# EAGLE design mrShark 11 (EAGLE 6.4)

## Sheet 1 of 4
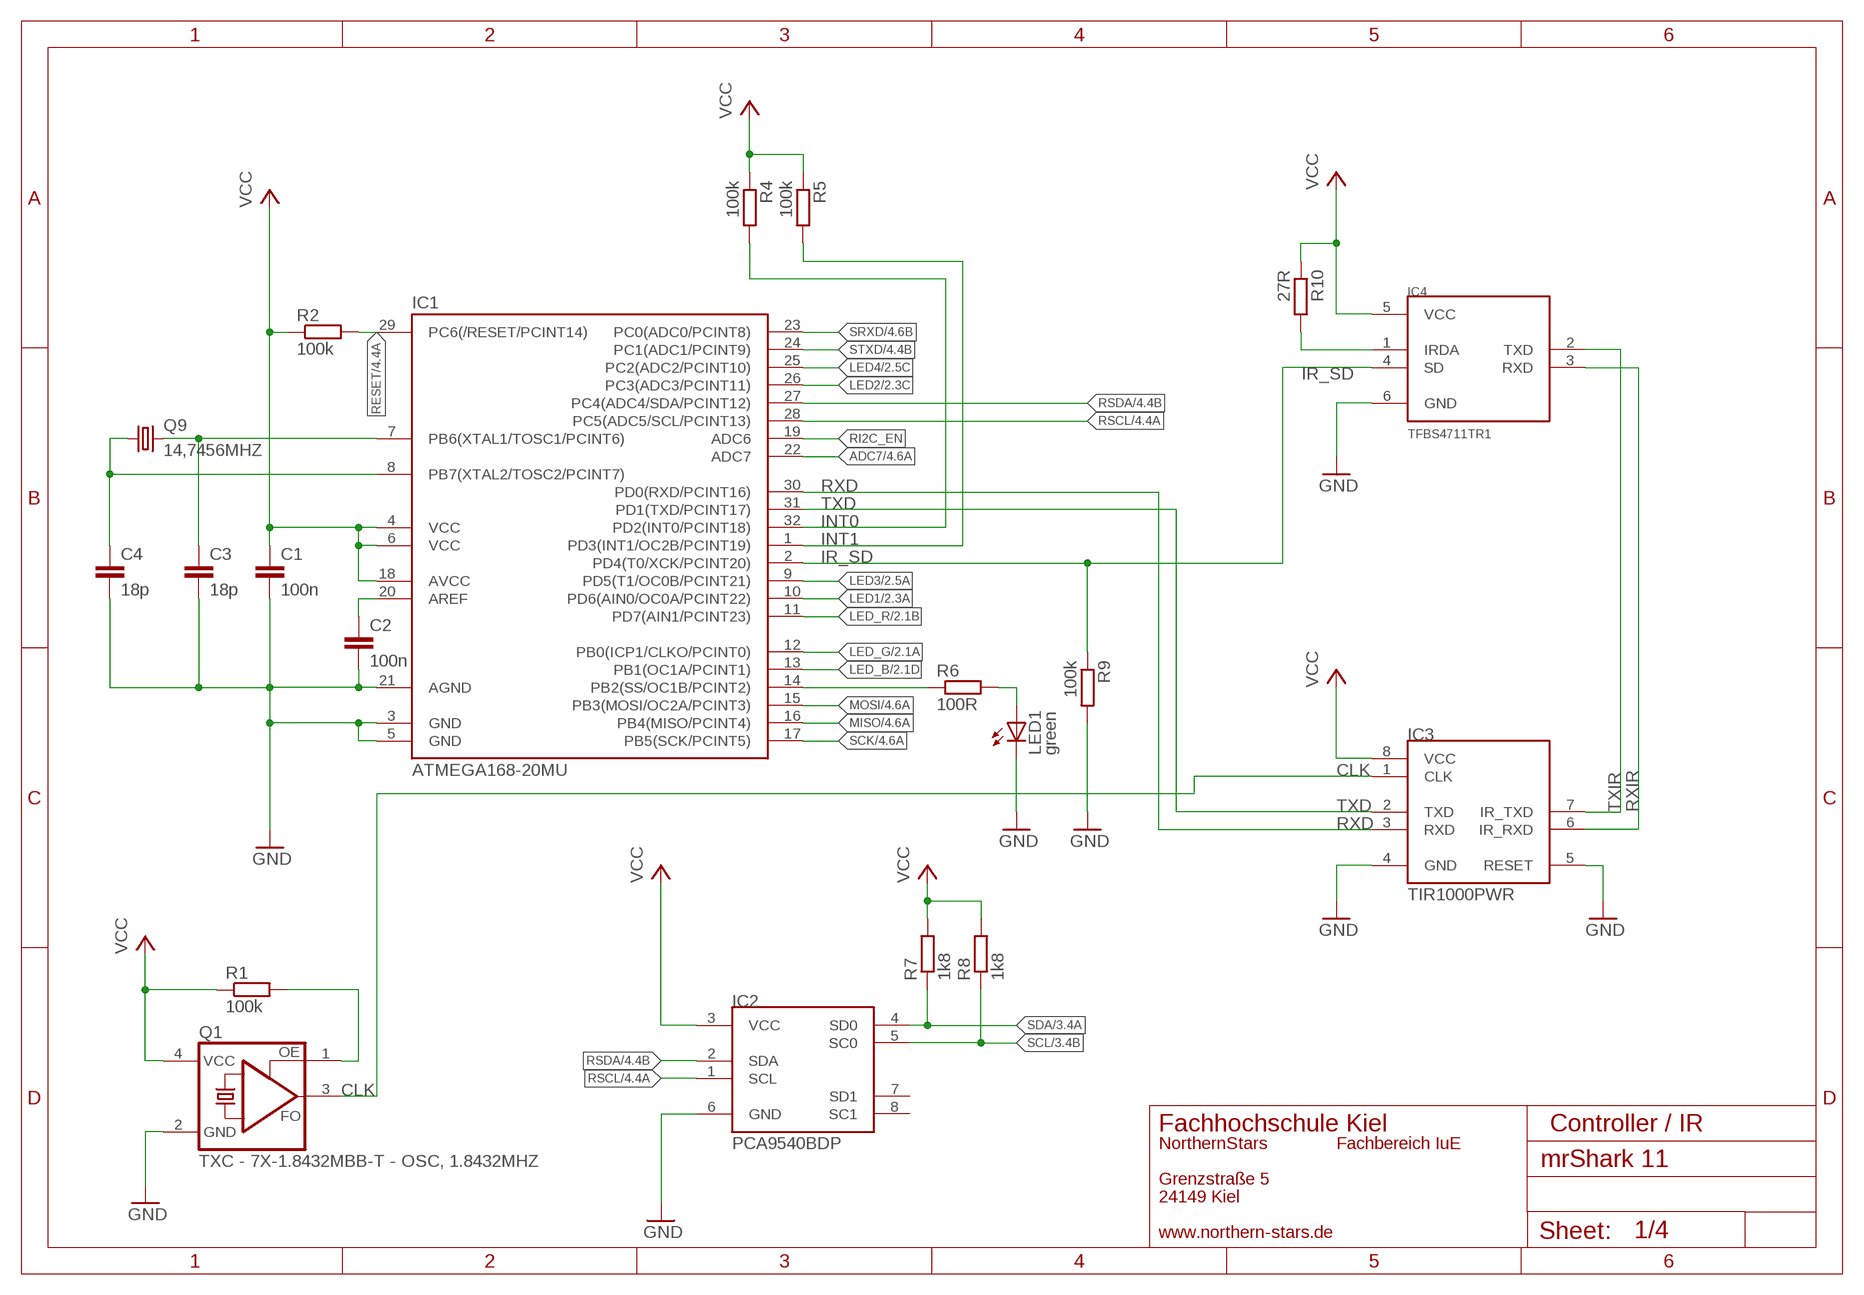
[diagram p0: schematic, sheet 1]

### Parts
C1  100n  C-EUC0201  [C0201]
C2  100n  C-EUC0201  [C0201]
C3  18p  C-EUC0201  [C0201]
C4  18p  C-EUC0201  [C0201]
IC1  ATMEGA168-20MU  ATMEGA48/88/168-MU  [MLF32]
IC2  PCA9540BDP  PCA9540TSSOP8  [TSSOP8]
IC3  TIR1000PWR  [PW_R-PDSO-G08]
IC4  TFBS4711TR1  [TFBS4711]
LED1  green  LEDCHIPLED_0603  [CHIPLED_0603]
Q1  TXC - 7X-1.8432MBB-T - OSC, 1.8432MHZ  7X-SERIES  [3.2X2.5]
Q9  14,7456MHZ  TXC-7B-SERIESSMD  [TXC_7B_SERIES]
R1  100k  R-EU_R0201  [R0201]
R2  100k  R-EU_R0201  [R0201]
R4  100k  R-EU_R0201  [R0201]
R5  100k  R-EU_R0201  [R0201]
R6  100R  R-EU_R0201  [R0201]
R7  1k8  R-EU_R0201  [R0201]
R8  1k8  R-EU_R0201  [R0201]
R9  100k  R-EU_R0201  [R0201]
R10  27R  R-EU_R0201  [R0201]

### Nets
ADC7: IC1.22(ADC7) ; also sheet 4
CLK: IC3.1(CLK) Q1.3(FO)
GND: C1.2 C2.2 C3.2 C4.2 IC1.3(GND) IC1.5(GND) IC1.21(AGND) IC2.6(GND) IC3.4(GND) IC3.5(RESET) IC4.6(GND) LED1.C Q1.2(GND) R9.2 ; also sheet 2,3,4
INT0: IC1.32(PD2(INT0/PCINT18)) R4.2 ; also sheet 4
INT1: IC1.1(PD3(INT1/OC2B/PCINT19)) R5.2 ; also sheet 4
IR_SD: IC1.2(PD4(T0/XCK/PCINT20)) IC4.4(SD) R9.1
IRDA: IC4.1(IRDA) R10.2
LED1: IC1.10(PD6(AIN0/OC0A/PCINT22)) ; also sheet 2
LED2: IC1.26(PC3(ADC3/PCINT11)) ; also sheet 2
LED3: IC1.9(PD5(T1/OC0B/PCINT21)) ; also sheet 2
LED4: IC1.25(PC2(ADC2/PCINT10)) ; also sheet 2
LED_B: IC1.13(PB1(OC1A/PCINT1)) ; also sheet 2
LED_G: IC1.12(PB0(ICP1/CLKO/PCINT0)) ; also sheet 2
LED_R: IC1.11(PD7(AIN1/PCINT23)) ; also sheet 2
MISO: IC1.16(PB4(MISO/PCINT4)) ; also sheet 4
MOSI: IC1.15(PB3(MOSI/OC2A/PCINT3)) ; also sheet 4
N$3: IC1.14(PB2(SS/OC1B/PCINT2)) R6.1
N$4: Q1.1(OE) R1.2
N$8: LED1.A R6.2
N$26: C2.1 IC1.20(AREF)
RESET: IC1.29(PC6(/RESET/PCINT14)) R2.2 ; also sheet 4
RI2C_EN: IC1.19(ADC6)
RSCL: IC1.28(PC5(ADC5/SCL/PCINT13)) IC2.1(SCL) ; also sheet 4
RSDA: IC1.27(PC4(ADC4/SDA/PCINT12)) IC2.2(SDA) ; also sheet 4
RXD: IC1.30(PD0(RXD/PCINT16)) IC3.3(RXD)
RXIR: IC3.6(IR_RXD) IC4.3(RXD)
SCK: IC1.17(PB5(SCK/PCINT5)) ; also sheet 4
SCL: IC2.5(SC0) R8.1 ; also sheet 3,4
SDA: IC2.4(SD0) R7.1 ; also sheet 3,4
SRXD: IC1.23(PC0(ADC0/PCINT8)) ; also sheet 4
STXD: IC1.24(PC1(ADC1/PCINT9)) ; also sheet 4
TXD: IC1.31(PD1(TXD/PCINT17)) IC3.2(TXD)
TXIR: IC3.7(IR_TXD) IC4.2(TXD)
VCC: C1.1 IC1.4(VCC) IC1.6(VCC) IC1.18(AVCC) IC2.3(VCC) IC3.8(VCC) IC4.5(VCC) Q1.4(VCC) R1.1 R2.1 R4.1 R5.1 R7.2 R8.2 R10.1 ; also sheet 2,3,4
XTAL1: C3.1 IC1.7(PB6(XTAL1/TOSC1/PCINT6)) Q9.3
XTAL2: C4.1 IC1.8(PB7(XTAL2/TOSC2/PCINT7)) Q9.1
Unconnected: IC2.7(SD1) IC2.8(SC1)

### Notes on the sheet
- Fachhochschule Kiel | Controller / IR
- NorthernStars | Fachbereich IuE
- Grenzstraße 5
- 24149 Kiel
- www.northern-stars.de

## Sheet 2 of 4
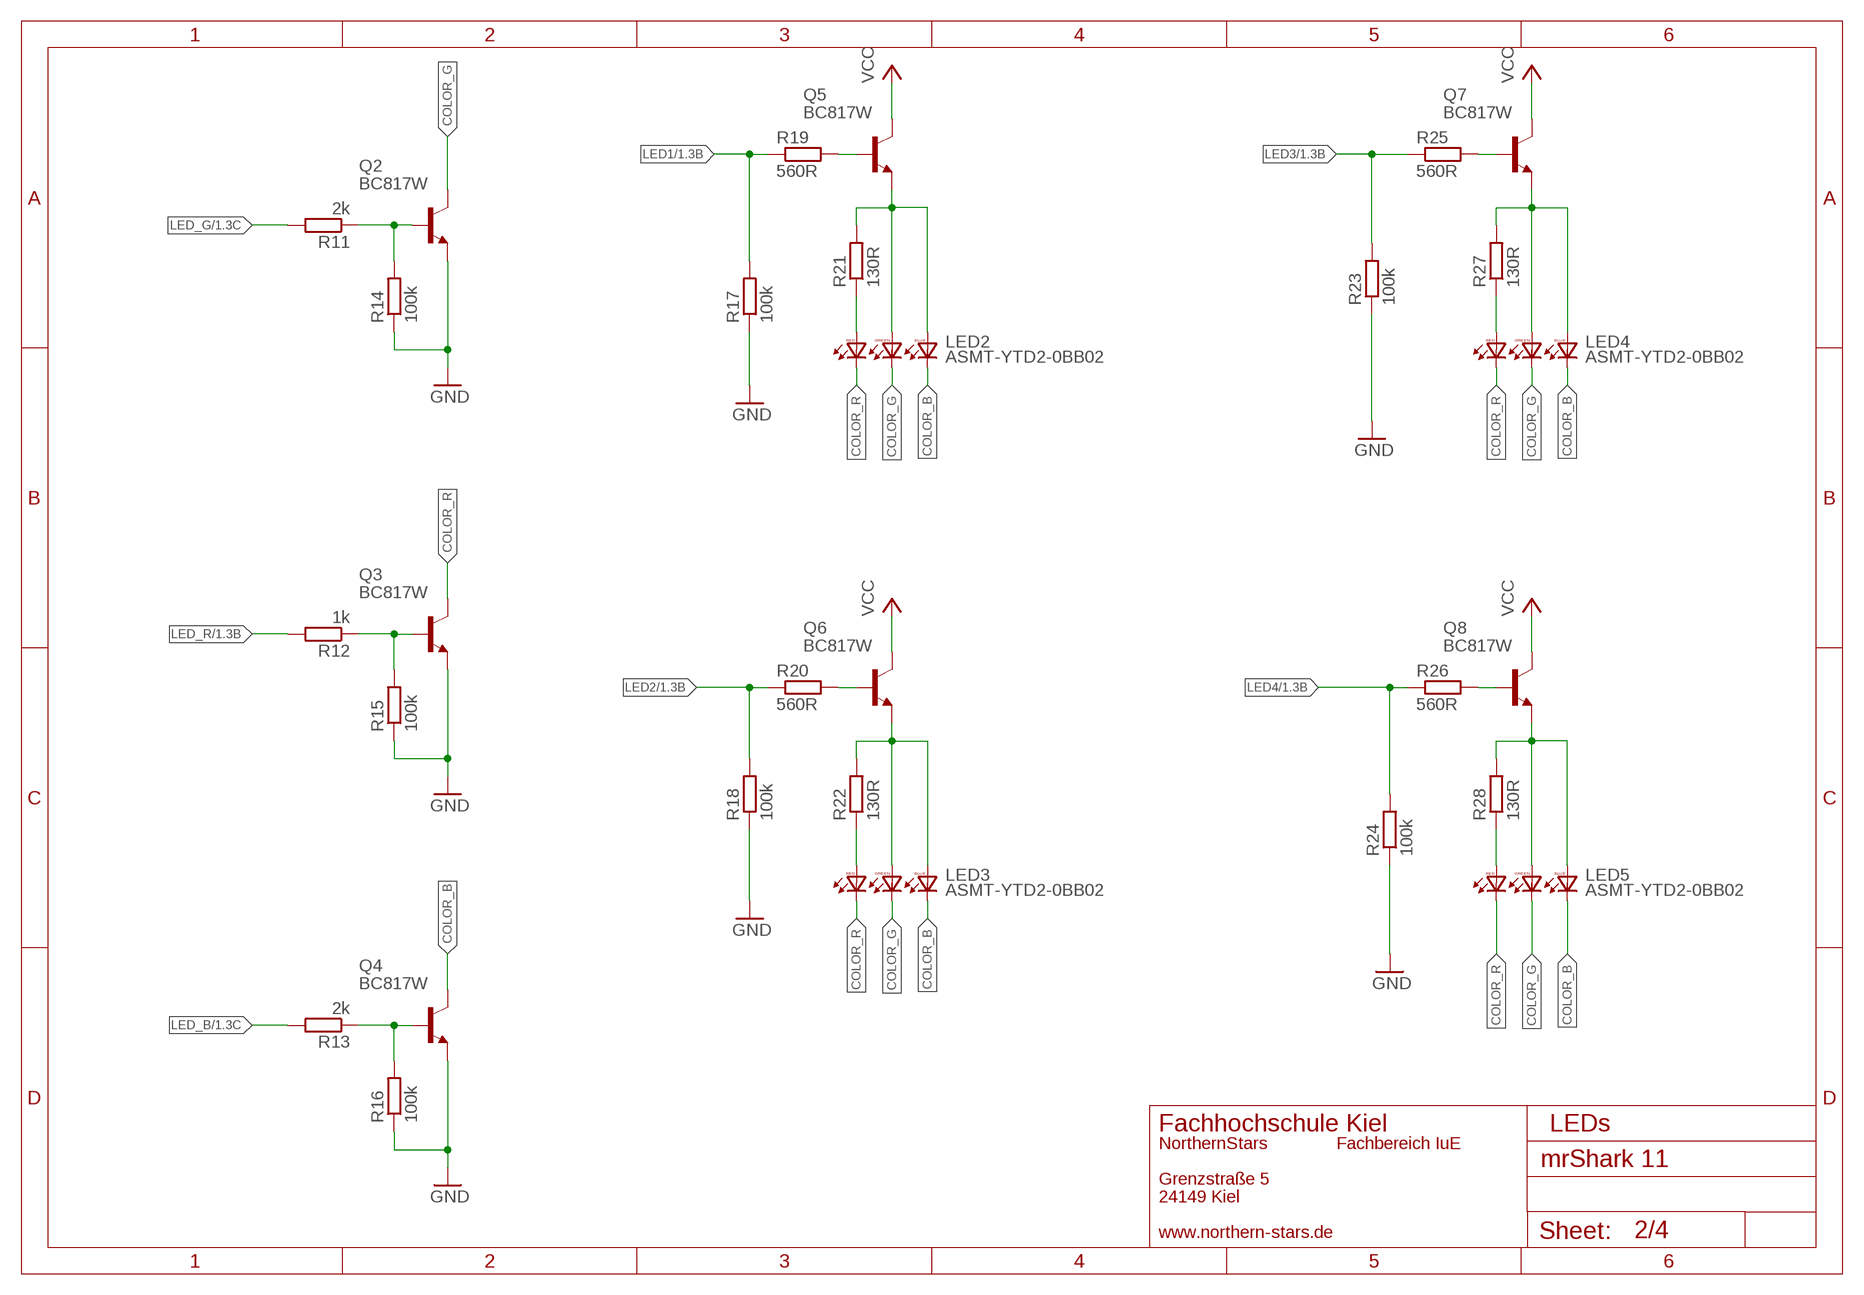
[diagram p1: schematic, sheet 2]

### Parts
LED2  ASMT-YTD2-0BB02  PLCC6K  [PLCC6K]
LED3  ASMT-YTD2-0BB02  PLCC6K  [PLCC6K]
LED4  ASMT-YTD2-0BB02  PLCC6K  [PLCC6K]
LED5  ASMT-YTD2-0BB02  PLCC6K  [PLCC6K]
Q2  BC817W  [SOT323-BEC]
Q3  BC817W  [SOT323-BEC]
Q4  BC817W  [SOT323-BEC]
Q5  BC817W  [SOT323-BEC]
Q6  BC817W  [SOT323-BEC]
Q7  BC817W  [SOT323-BEC]
Q8  BC817W  [SOT323-BEC]
R11  2k  R-EU_R0201  [R0201]
R12  1k  R-EU_R0201  [R0201]
R13  2k  R-EU_R0201  [R0201]
R14  100k  R-EU_R0201  [R0201]
R15  100k  R-EU_R0201  [R0201]
R16  100k  R-EU_R0201  [R0201]
R17  100k  R-EU_R0201  [R0201]
R18  100k  R-EU_R0201  [R0201]
R19  560R  R-EU_R0201  [R0201]
R20  560R  R-EU_R0201  [R0201]
R21  130R  R-EU_R0201  [R0201]
R22  130R  R-EU_R0201  [R0201]
R23  100k  R-EU_R0201  [R0201]
R24  100k  R-EU_R0201  [R0201]
R25  560R  R-EU_R0201  [R0201]
R26  560R  R-EU_R0201  [R0201]
R27  130R  R-EU_R0201  [R0201]
R28  130R  R-EU_R0201  [R0201]

### Nets
COLOR_B: LED2.1(BC) LED3.1(BC) LED4.1(BC) LED5.1(BC) Q4.C
COLOR_G: LED2.2(GC) LED3.2(GC) LED4.2(GC) LED5.2(GC) Q2.C
COLOR_R: LED2.3(RC) LED3.3(RC) LED4.3(RC) LED5.3(RC) Q3.C
GND: Q2.E Q3.E Q4.E R14.1 R15.1 R16.1 R17.1 R18.1 R23.1 R24.1 ; also sheet 1,3,4
LED1: R17.2 R19.1 ; also sheet 1
LED2: R18.2 R20.1 ; also sheet 1
LED3: R23.2 R25.1 ; also sheet 1
LED4: R24.2 R26.1 ; also sheet 1
LED_B: R13.2 ; also sheet 1
LED_G: R11.2 ; also sheet 1
LED_R: R12.2 ; also sheet 1
N$5: LED2.4(RA) R21.1
N$10: LED4.4(RA) R27.1
N$11: LED4.5(GA) LED4.6(BA) Q7.E R27.2
N$15: LED3.4(RA) R22.1
N$16: LED3.5(GA) LED3.6(BA) Q6.E R22.2
N$19: Q6.B R20.2
N$20: LED5.4(RA) R28.1
N$22: LED5.5(GA) LED5.6(BA) Q8.E R28.2
N$23: Q8.B R26.2
N$24: Q7.B R25.2
N$25: Q5.B R19.2
N$27: LED2.5(GA) LED2.6(BA) Q5.E R21.2
VCC: Q5.C Q6.C Q7.C Q8.C ; also sheet 1,3,4
X1: Q4.B R13.1 R16.2
X2: Q3.B R12.1 R15.2
X3: Q2.B R11.1 R14.2

### Notes on the sheet
- Fachhochschule Kiel | LEDs
- NorthernStars | Fachbereich IuE
- Grenzstraße 5
- 24149 Kiel
- www.northern-stars.de

## Sheet 3 of 4
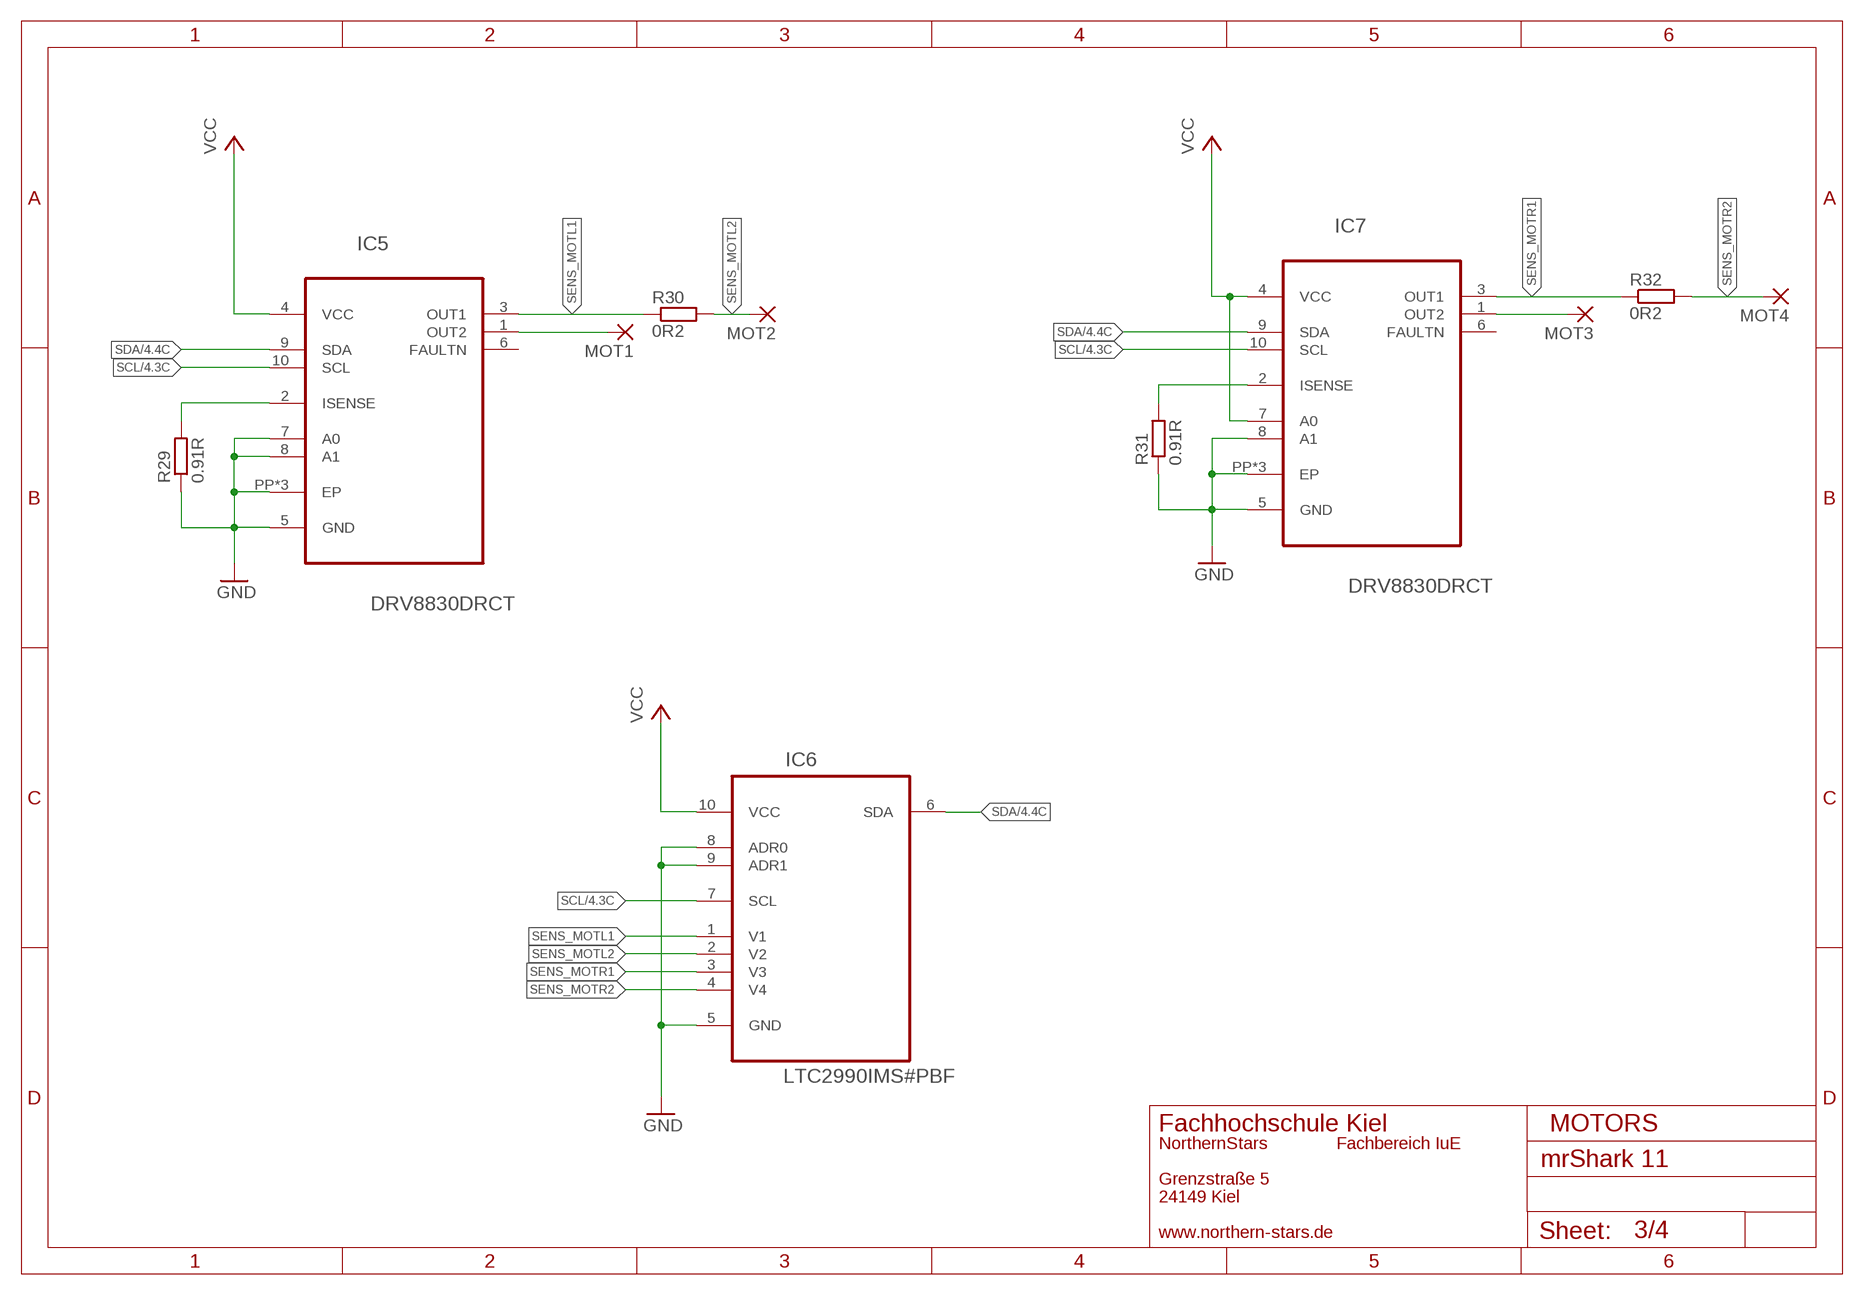
[diagram p2: schematic, sheet 3]

### Parts
IC5  DRV8830DRCT  DRV8830DGQRWSON  [S-PDSO-N10]
IC6  LTC2990IMS#PBF  LTC2990IMSPBF  [SOP50P490X110-10N]
IC7  DRV8830DRCT  DRV8830DGQRWSON  [S-PDSO-N10]
MOT1  1,6/0,9  [1,6/0,9]
MOT2  1,6/0,9  [1,6/0,9]
MOT3  1,6/0,9  [1,6/0,9]
MOT4  1,6/0,9  [1,6/0,9]
R29  0.91R  R-EU_R0603  [R0603]
R30  0R2  R-EU_R0603  [R0603]
R31  0.91R  R-EU_R0603  [R0603]
R32  0R2  R-EU_R0603  [R0603]

### Nets
GND: IC5.5(GND) IC5.7(A0) IC5.8(A1) IC5.PP(EP) IC5.PP@1(EP) IC5.PP@2(EP) IC6.5(GND) IC6.8(ADR0) IC6.9(ADR1) IC7.5(GND) IC7.8(A1) IC7.PP(EP) IC7.PP@1(EP) IC7.PP@2(EP) R29.1 R31.1 ; also sheet 1,2,4
N$1: IC5.1(OUT2) MOT1.1(P)
N$2: IC5.2(ISENSE) R29.2
N$6: IC7.1(OUT2) MOT3.1(P)
N$7: IC7.2(ISENSE) R31.2
SCL: IC5.10(SCL) IC6.7(SCL) IC7.10(SCL) ; also sheet 1,4
SDA: IC5.9(SDA) IC6.6(SDA) IC7.9(SDA) ; also sheet 1,4
SENS_MOTL1: IC5.3(OUT1) IC6.1(V1) R30.1
SENS_MOTL2: IC6.2(V2) MOT2.1(P) R30.2
SENS_MOTR1: IC6.3(V3) IC7.3(OUT1) R32.1
SENS_MOTR2: IC6.4(V4) MOT4.1(P) R32.2
VCC: IC5.4(VCC) IC6.10(VCC) IC7.4(VCC) IC7.7(A0) ; also sheet 1,2,4
Unconnected: IC5.6(FAULTN) IC7.6(FAULTN)

### Notes on the sheet
- Fachhochschule Kiel | MOTORS
- NorthernStars | Fachbereich IuE
- Grenzstraße 5
- 24149 Kiel
- www.northern-stars.de

## Sheet 4 of 4
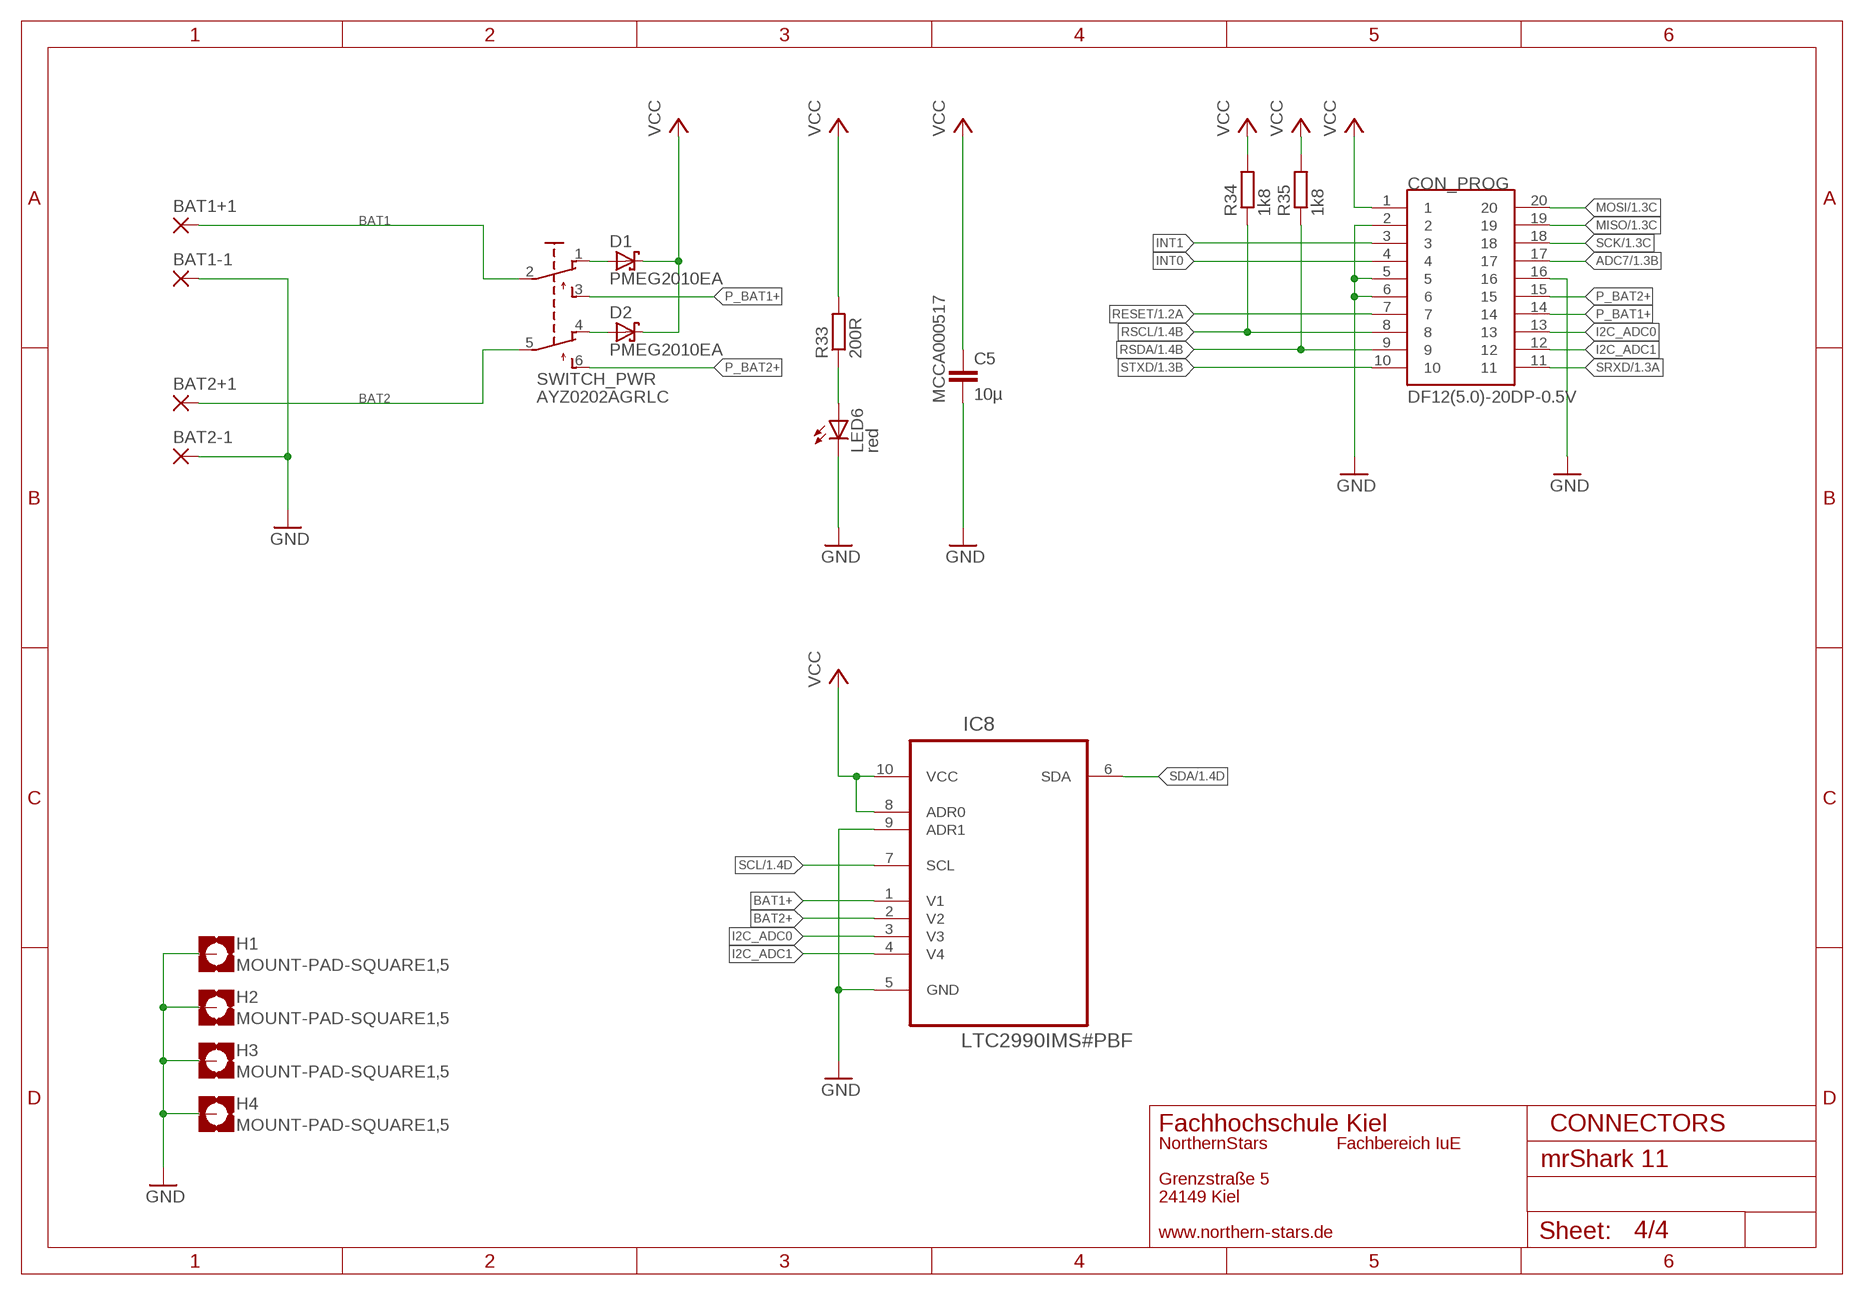
[diagram p3: schematic, sheet 4]

### Parts
BAT1+1  1,6/0,9  [1,6/0,9]
BAT1-1  1,6/0,9  [1,6/0,9]
BAT2+1  1,6/0,9  [1,6/0,9]
BAT2-1  1,6/0,9  [1,6/0,9]
C5  10µ  C-EUC0603K  [C0603K]
CON_PROG  DF12(5.0)-20DP-0.5V  DF12-20DP  [DF12-20DP]
D1  PMEG2010EA  PMEG2010EAR  [SOD323-R]
D2  PMEG2010EA  PMEG2010EAR  [SOD323-R]
H1  MOUNT-PAD-SQUARE1,5  [0,75-PAD-SQUARE]
H2  MOUNT-PAD-SQUARE1,5  [0,75-PAD-SQUARE]
H3  MOUNT-PAD-SQUARE1,5  [0,75-PAD-SQUARE]
H4  MOUNT-PAD-SQUARE1,5  [0,75-PAD-SQUARE]
IC8  LTC2990IMS#PBF  LTC2990IMSPBF  [SOP50P490X110-10N]
LED6  red  LEDCHIPLED_0603  [CHIPLED_0603]
R33  200R  R-EU_R0201  [R0201]
R34  1k8  R-EU_R0201  [R0201]
R35  1k8  R-EU_R0201  [R0201]
SWITCH_PWR  AYZ0202AGRLC  [AYZ0202AGLRC]

### Nets
ADC7: CON_PROG.17 ; also sheet 1
BAT1: BAT1+1.1(P) SWITCH_PWR.2(P)
BAT1+: D1.A IC8.1(V1) SWITCH_PWR.1(O)
BAT2: BAT2+1.1(P) SWITCH_PWR.5(P1)
BAT2+: D2.A IC8.2(V2) SWITCH_PWR.4(O1)
GND: BAT1-1.1(P) BAT2-1.1(P) C5.2 CON_PROG.2 CON_PROG.5 CON_PROG.6 CON_PROG.16 H1.P(MOUNT) H2.P(MOUNT) H3.P(MOUNT) H4.P(MOUNT) IC8.5(GND) IC8.9(ADR1) LED6.C ; also sheet 1,2,3
I2C_ADC0: CON_PROG.13 IC8.3(V3)
I2C_ADC1: CON_PROG.12 IC8.4(V4)
INT0: CON_PROG.4 ; also sheet 1
INT1: CON_PROG.3 ; also sheet 1
MISO: CON_PROG.19 ; also sheet 1
MOSI: CON_PROG.20 ; also sheet 1
N$28: LED6.A R33.1
P_BAT1+: CON_PROG.14 SWITCH_PWR.3(S)
P_BAT2+: CON_PROG.15 SWITCH_PWR.6(S1)
RESET: CON_PROG.7 ; also sheet 1
RSCL: CON_PROG.8 R34.1 ; also sheet 1
RSDA: CON_PROG.9 R35.1 ; also sheet 1
SCK: CON_PROG.18 ; also sheet 1
SCL: IC8.7(SCL) ; also sheet 1,3
SDA: IC8.6(SDA) ; also sheet 1,3
SRXD: CON_PROG.11 ; also sheet 1
STXD: CON_PROG.10 ; also sheet 1
VCC: C5.1 CON_PROG.1 D1.C D2.C IC8.8(ADR0) IC8.10(VCC) R33.2 R34.2 R35.2 ; also sheet 1,2,3

### Notes on the sheet
- MCCA000517
- Fachhochschule Kiel | CONNECTORS
- NorthernStars | Fachbereich IuE
- Grenzstraße 5
- 24149 Kiel
- www.northern-stars.de

## Library data of the parts
BAT1+1 BAT1-1 BAT2+1 BAT2-1 MOT1-MOT4 = wirepad:1,6/0,9: THROUGH-HOLE PAD
C1-C5 = rcl:C-EU: CAPACITOR, European symbol
CON_PROG = con-hirose:DF12-20: HRS-Hirose DF12-Series 0.5mm Pitch SMT Board to Board Connector 20 contacts
D1 D2 = diode:PMEG2010EA: NXP - Low V F (MEGA) Schottky barrier diode If = 1A, Vr = 20V http://www.farnell.com/datasheets/687996.pdf
H1-H4 = holes:MOUNT-PAD-SQUARE: MOUNTING PAD, square
IC1 = atmega8:ATMEGA48/88/168
IC2 = nxp:PCA9540: PCA9540 2-channel I2C-bus multiplexer
IC3 = texas:TIR1000: Texas Instruments TIR1000 STANDALONE IrDATM ENCODER AND DECODER
IC4 = vishay:TFBS4711: TRANSCEIVER IRDA Vishay TFBS4711-TR1 Infrared Transciever 900nm, 600µA, 1m range
IC5 IC7 = texas:DRV8830DGQR: LOW-VOLTAGE MOTOR DRIVER WITH SERIAL INTERFACE
IC6 IC8 = linear-technology:LTC2990IMSPBF: Quad I2C Voltage, Current and Temperature Monitor Measures Voltage, Current and Temperature Measures Two Remote Diode Temperatures; DESCRIPTION: I2C Temperature, Voltage and Current Monitor; MPN: LTC2990IMS#PBF; OC_FARNELL: 1898629; OC_NEWARK: 13T3889; PACKAGE: MSOP-10; SUPPLIER: Linear Technology
LED1 LED6 = led:LED: LED OSRAM: - CHIPLED LG R971, LG N971, LY N971, LG Q971, LY Q971, LO R971, LY R971 LH N974, LH R974 LS Q976, LO Q976, LY Q976 LO Q996 - Hyper CHIPLED LW Q18S LB Q993, LB Q99A, LB R99A - SideLED LS A670, LO A670, LY A670, LG A670, LP A670 LB A673, LV A673, LT A673, LW A673 LH A674 LY A675 LS A676, LA A676, LO A676, LY A676, LW A676 LS A679, LY A679, LG A679 - Hyper Micro SIDELED® LS Y876, LA Y876, LO Y876, LY Y876 LT Y87S - SmartLED LW L88C, LW L88S LB L89C, LB L89S, LG L890 LS L89K, LO L89K, LY L89K LS L896, LA L896, LO L896, LY L896 - TOPLED LS T670, LO T670, LY T670, LG T670, LP T670 LSG T670, LSP T670, LSY T670, LOP T670, LYG T670 LG T671, LOG T671, LSG T671 LB T673, LV T673, LT T673, LW T673 LH T674 LS T676, LA T676, LO T676, LY T676, LB T676, LH T676, LSB T676, LW T676 LB T67C, LV T67C, LT T67C, LS T67K, LO T67K, LY T67K, LW E67C LS E67B, LA E67B, LO E67B, LY E67B, LB E67C, LV E67C, LT E67C LW T67C LS T679, LY T679, LG T679 LS T770, LO T770, LY T770, LG T770, LP T770 LB T773, LV T773, LT T773, LW T773 LH T774 LS E675, LA E675, LY E675, LS T675 LS T776, LA T776, LO T776, LY T776, LB T776 LHGB T686 LT T68C, LB T68C - Hyper Mini TOPLED® LB M676 - Mini TOPLED Santana® LG M470 LS M47K, LO M47K, LY M47K Source: http://www.osram.convergy.de LUXEON: - LUMILED® LXK2-PW12-R00, LXK2-PW12-S00, LXK2-PW14-U00, LXK2-PW14-V00 LXK2-PM12-R00, LXK2-PM12-S00, LXK2-PM14-U00 LXK2-PE12-Q00, LXK2-PE12-R00, LXK2-PE12-S00, LXK2-PE14-T00, LXK2-PE14-U00 LXK2-PB12-K00, LXK2-PB12-L00, LXK2-PB12-M00, LXK2-PB14-N00, LXK2-PB14-P00, LXK2-PB14-Q00 LXK2-PR12-L00, LXK2-PR12-M00, LXK2-PR14-Q00, LXK2-PR14-R00 LXK2-PD12-Q00, LXK2-PD12-R00, LXK2-PD12-S00 LXK2-PH12-R00, LXK2-PH12-S00 LXK2-PL12-P00, LXK2-PL12-Q00, LXK2-PL12-R00 Source: www.luxeon.com KINGBRIGHT: KA-3528ASYC Source: www.kingbright.com
LED2-LED5 = led:PLCC6: Standart PLCC6 Package RGB LED
Q1 = crystal:7X-SERIES: TXC 7X SERIES 3.2 x 2.5 mm SMD CMOS CXO
Q2-Q8 = transistor-npn:BC817*: NPN Transistor
Q9 = crystal:TXC-7B-SERIES: TXC 7B SERIES Ultra small SMD type cristial 8-100Mhz
R1 R2 R4-R35 = rcl:R-EU_: RESISTOR, European symbol
SWITCH_PWR = switch:AYZ0202AGRLC: AYZ Switch Series SMD Switch 3.5x7.2mm

## Board
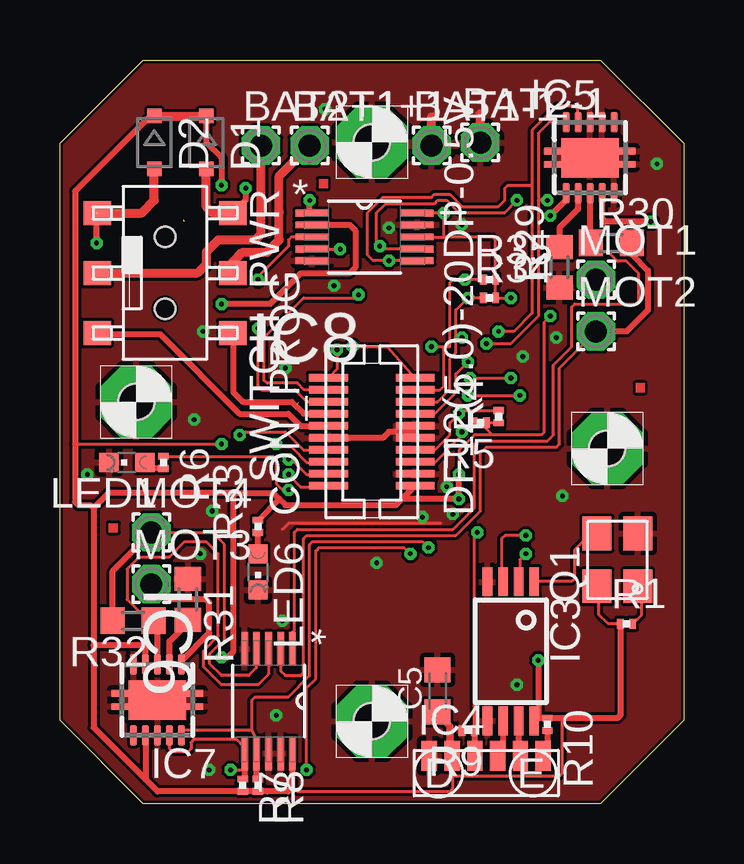
[diagram p4: board, top side]
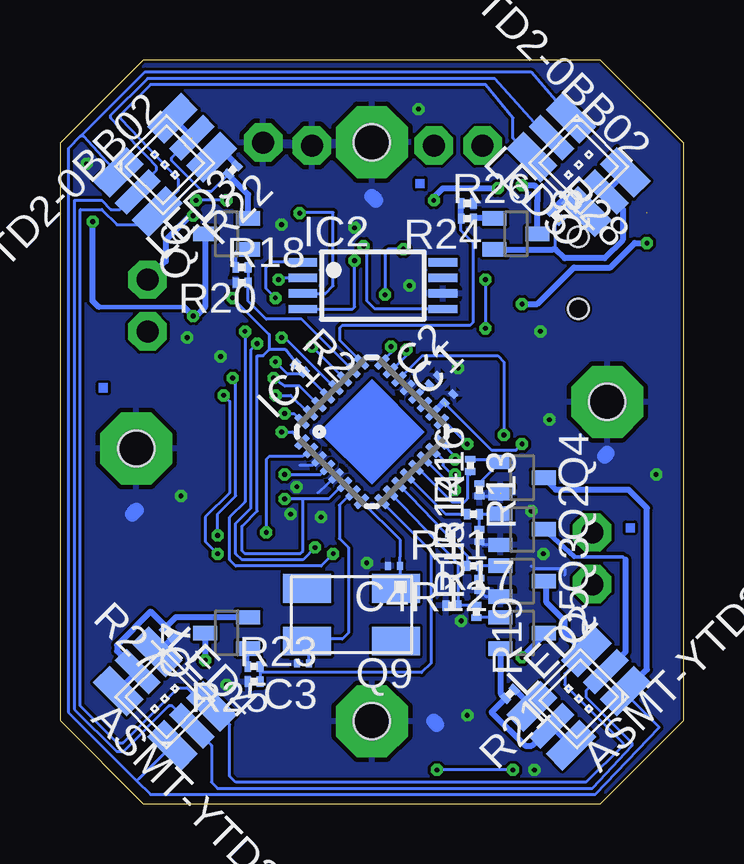
[diagram p5: board, bottom side, seen from below]

Size 26 x 31 mm. Coordinates in mm from the lower left corner, seen from the top.
Outline: 0,3.47 0,27.53 3.47,31 22.53,31 26,27.53 26,3.47 22.53,0 3.47,0 0,3.47
Copper layers (1*16): Top 0.035mm / dielectric 1.5mm / Bottom 0.035mm
Design rules "default": minimum track width 5mil, minimum drill 0.2mm, track to track 5mil, track to pad 5mil, pad to pad 5mil, via to via 5mil, smd to smd 5mil, copper to edge 5mil, drill to drill 5mil, minimum pad ring 0.15mm, minimum via ring 0.15mm, stop-mask expansion 0.075mm, vias tented up to drill 0mil, thermal gap 0.2mm

### Footprints (pad centres in the part's own frame; a part is rotated, then mirrored left to right if it is on the bottom)
1,6/0,9 = drill 0.914 pad 1.6 octagon: 1 0,0
C0201 = smd 0.25 x 0.35: 1 -0.25,0; 2 0.25,0
C0603K = smd 1.05 x 1.08: 1 -0.875,0; 2 0.875,0
DF12-20DP = smd 0.32 x 1.62: 1 -2.25,-1.81; 2 -1.75,-1.81; 3 -1.25,-1.81; 4 -0.75,-1.81; 5 -0.25,-1.81; 6 0.25,-1.81; 7 0.75,-1.81; 8 1.25,-1.81; 9 1.75,-1.81; 10 2.25,-1.81; 11 2.25,1.81; 12 1.75,1.81; 13 1.25,1.81; 14 0.75,1.81; 15 0.25,1.81; 16 -0.25,1.81; 17 -0.75,1.81; 18 -1.25,1.81; 19 -1.75,1.81; 20 -2.25,1.81
SOD323-R = smd 0.6 x 0.6: A 1.1,0; C -1.1,0
0,75-PAD-SQUARE = drill 1.6 pad 3 octagon: P 0,0 | hole 1.5: 0,0
MLF32 = smd 0.7 x 0.3: 1 -2.35,1.75; 2 -2.35,1.25; 3 -2.35,0.75; 4 -2.35,0.25; 5 -2.35,-0.25; 6 -2.35,-0.75; 7 -2.35,-1.25; 8 -2.35,-1.75; 17 2.35,-1.75; 18 2.35,-1.25; 19 2.35,-0.75; 20 2.35,-0.25; 21 2.35,0.25; 22 2.35,0.75; 23 2.35,1.25; 24 2.35,1.75 | smd 0.3 x 0.7: 9 -1.75,-2.35; 10 -1.25,-2.35; 11 -0.75,-2.35; 12 -0.25,-2.35; 13 0.25,-2.35; 14 0.75,-2.35; 15 1.25,-2.35; 16 1.75,-2.35; 25 1.75,2.35; 26 1.25,2.35; 27 0.75,2.35; 28 0.25,2.35; 29 -0.25,2.35; 30 -0.75,2.35; 31 -1.25,2.35; 32 -1.75,2.35
TSSOP8 = smd 1.2 x 0.35: 1 -2.925,0.975; 2 -2.925,0.325; 3 -2.925,-0.325; 4 -2.925,-0.975; 5 2.925,-0.975; 6 2.925,-0.325; 7 2.925,0.325; 8 2.925,0.975
PW_R-PDSO-G08 = smd 0.4 x 1.2: 1 -0.975,-2.9; 2 -0.325,-2.9; 3 0.325,-2.9; 4 0.975,-2.9; 5 0.975,2.9; 6 0.325,2.9; 7 -0.325,2.9; 8 -0.975,2.9
TFBS4711 = smd 0.635 x 1.27: 1 2.37,0.72; 2 1.42,0.72; 3 0.47,0.72; 4 -0.48,0.72; 5 -1.43,0.72; 6 -2.38,0.72
S-PDSO-N10 = smd 0.28 x 0.85: 1 -1,-1.475; 2 -0.5,-1.475; 3 0,-1.475; 4 0.5,-1.475; 5 1,-1.475; 6 1,1.475; 7 0.5,1.475; 8 0,1.475; 9 -0.5,1.475; 10 -1,1.475 | smd 2.4 x 1.65: PP 0,0 | smd 3.8 x 0.28: PP@1 0,0.275; PP@2 0,-0.275
SOP50P490X110-10N = smd 1.397 x 0.279: 1 -2.184,0.991; 2 -2.184,0.508; 3 -2.184,0; 4 -2.184,-0.508; 5 -2.184,-0.991; 6 2.184,-0.991; 7 2.184,-0.508; 8 2.184,0; 9 2.184,0.508; 10 2.184,0.991
CHIPLED_0603 = smd 0.8 x 0.8: A 0,-0.75; C 0,0.75
PLCC6K = smd 2 x 1: 1 1.6,-1.15; 3 1.6,1.15; 4 -1.6,1.15; 6 -1.6,-1.15 | smd 2 x 0.7: 2 1.6,0; 5 -1.6,0
3.2X2.5 = smd 1.4 x 1.2: 1 -1.1,-0.85; 2 1.1,-0.85; 3 1.1,0.85; 4 -1.1,0.85
SOT323-BEC = smd 0.6 x 1: B -0.65,-0.9; C 0,0.9; E 0.65,-0.9
TXC_7B_SERIES = smd 2 x 1.2: 1 -1.85,-1.1; 2 1.85,-1.1; 3 1.85,1.1; 4 -1.85,1.1
R0201 = smd 0.28 x 0.43: 1 -0.255,0; 2 0.255,0
R0603 = smd 1 x 1.1: 1 -0.85,0; 2 0.85,0
AYZ0202AGLRC = smd 1 x 1.15: 1 -2.5,2.825; 2 0,2.825; 3 2.5,2.825; 4 -2.5,-2.825; 5 0,-2.825; 6 2.5,-2.825 | hole 0.85: -1.5,0; 1.5,0

### Placement (x,y rotation side)
BAT1+1  10.41,27.43 0 top
BAT1-1  15.49,27.43 0 top
BAT2+1  8.38,27.43 0 top
BAT2-1  17.53,27.56 0 top
C1  9.78,16.89 45 bottom
C2  10.41,17.65 45 bottom
C3  15.88,5.84 180 bottom
C4  12.06,9.91 180 bottom
C5  15.75,4.7 90 top
CON_PROG  13,15.5 90 top
D1  6.1,27.56 270 top
D2  3.94,27.56 270 top
H1  13,3.43 0 top
H2  13,27.57 0 top
H3  3.18,16.75 0 top
H4  22.82,14.8 0 top
IC1  13,15.5 45 bottom
IC2  12.95,21.59 0 bottom
IC3  18.8,6.35 180 top
IC4  17.78,1.27 0 top
IC5  22.1,26.92 0 top
IC6  8.7,4.27 270 top
IC7  4.06,4.32 180 top
IC8  12.7,23.62 0 top
LED1  2.79,14.22 90 top
LED2  4.37,4.37 45 bottom
LED3  21.63,26.63 225 bottom
LED4  21.63,4.37 315 bottom
LED5  4.37,26.63 135 bottom
LED6  8.26,9.65 180 top
MOT1  22.35,21.84 0 top
MOT2  22.35,19.68 0 top
MOT3  3.81,9.14 0 top
MOT4  3.81,11.3 0 top
Q1  23.24,10.16 90 top
Q2  6.73,11.43 270 bottom
Q3  6.73,9.27 270 bottom
Q4  6.73,13.59 270 bottom
Q5  6.73,7.11 270 bottom
Q6  19.05,23.75 90 bottom
Q7  19.05,7.11 90 bottom
Q8  6.99,23.75 270 bottom
Q9  13.84,7.87 180 bottom
R1  23.62,7.49 0 top
R2  16,18.16 315 bottom
R4  18.29,16.13 90 top
R5  17.53,15.88 180 top
R6  4.32,14.22 270 top
R7  7.62,0.76 270 top
R8  8.26,0.76 270 top
R9  17.02,3.05 180 top
R10  20.32,3.3 270 top
R11  8.76,12.06 180 bottom
R12  8.76,9.91 180 bottom
R13  8.89,14.1 270 bottom
R14  8.51,11.18 90 bottom
R15  8.51,9.14 90 bottom
R16  8.51,13.08 90 bottom
R17  9.65,8.26 0 bottom
R18  18.41,21.72 0 bottom
R19  8.64,8 270 bottom
R20  18.41,22.35 180 bottom
R21  7.24,4.57 225 bottom
R22  18.8,26.42 225 bottom
R23  17.91,5.08 0 bottom
R24  9.02,25.02 180 bottom
R25  17.91,5.71 180 bottom
R26  9.02,24.38 0 bottom
R27  21.46,7.11 135 bottom
R28  5.33,24.51 315 bottom
R29  20.83,22.35 90 top
R30  22.99,23.37 0 top
R31  5.33,8.51 270 top
R32  3.05,7.62 180 top
R33  8.26,11.56 90 top
R34  17.91,21.08 0 top
R35  17.91,21.84 0 top
SWITCH_PWR  4.38,22.12 270 top

### Tracks (layer width: path | path; a pad name or v marks a point on that pad's centre or on a via)
ADC7  (via drill 0.2)
  Top 0.127: CON_PROG.17 11.17,14.73 10.16,14.73 9.4,15.49 7.75,15.49 7.62,15.37 v7.49,15.37
  Bottom 0.127: IC1.22 10.89,18.67 7.75,18.67 7.49,18.41 v7.49,15.37
BAT1
  Top 0.254: 9.14,24.61 9.14,24.64
  Top 0.381: SWITCH_PWR.2 7.21,22.58 7.62,22.99 8.64,22.99 9.14,23.5 9.14,24.64 9.14,26.16 BAT1+1.1
BAT1+  (via drill 0.2 pad 0.5)
  Top 0.254: IC8.1 10.41,24.71 v10.41,25.15 | v7.75,25.65 7.75,25.16 SWITCH_PWR.1
  Top 0.381: SWITCH_PWR.1 6.37,24.62 6.1,24.89 D1.A
  Bottom 0.254: v10.41,25.15 10.41,25.27 10.03,25.65 v7.75,25.65
BAT2
  Top 0.381: SWITCH_PWR.5 5.74,22.12 6.1,22.48 6.1,22.99 6.6,23.5 8.13,23.5 8.38,23.75 BAT2+1.1
BAT2+  (via drill 0.2 pad 0.5)  (1 unrouted)
  Top 0.254: IC8.2 12.06,24.13 12.32,23.88 12.32,22.35 12.06,22.1 10.03,22.1 8.76,20.83 v6.73,20.83 | v1.52,23.37 1.52,24.64
  Top 0.381: SWITCH_PWR.4 3.41,24.62 3.94,25.15 D2.A
  Bottom 0.254: v6.73,20.83 6.1,20.83 4.57,22.35 3.05,22.35 2.03,23.37 v1.52,23.37
CLK
  Top 0.127: IC3.1 19.81,9.29 21.36,9.29 21.46,9.4 21.46,10.59 22.14,11.26 Q1.3
COLOR_B
  Bottom 0.127: 25.02,27.81 25.08,27.88 22.48,30.48 6.34,30.48 LED5.1 | LED3.1 23.64,26.31 25.02,27.81 | 25.02,27.81 25.15,27.81 25.65,27.3 25.65,3.81 22.8,0.95 | 22.73,1.02 21.32,2.42 LED4.1 22.72,1.02 22.73,1.02 | 22.73,1.02 22.8,0.95 | 22.8,0.95 22.23,0.38 3.68,0.38 1.02,3.17 2.42,4.58 LED2.1
  Bottom 0.254: LED2.1 1.52,5.59 1.52,12.32 2.29,13.08 5.32,13.08 Q4.C 5.84,13.58
COLOR_G
  Bottom 0.127: LED5.2 5.66,27.76 7.87,30.23 22.35,30.23 23.88,28.7 23.88,28.57 21.97,26.54 21.97,26.42 22.76,25.63 LED3.2 23.5,24.77 23.88,24.77 24.26,25.15 25.4,25.15 25.4,3.94 23.62,2.16 23.37,2.16 21.46,4.06 21.32,4.06 LED4.2 19.68,2.42 19.68,0.89 19.43,0.64 3.81,0.64 2.16,2.41 2.16,2.54 4.06,4.45 4.06,4.7 3.26,5.5 LED2.2
  Bottom 0.152: 2.41,10.16 2.54,10.29 4.56,10.29
  Bottom 0.203: 4.56,10.29 Q2.C
  Bottom 0.254: LED2.2 2.41,6.33 2.41,10.16
COLOR_R
  Bottom 0.127: LED5.3 7.11,27.75 7.11,28.57 8.26,29.97 22.23,29.97 23.5,28.7 23.5,28.57 21.08,26.04 21.08,25.55 LED3.3 21.95,24.66 22.48,24.13 23.62,24.13 24.26,24.77 25.15,24.77 25.15,4.06 23.62,2.54 23.37,2.54 21.08,4.83 20.7,4.83 19.93,4.05 LED4.3 19.67,4.05 18.92,3.3 18.92,1.14 18.67,0.89 4.06,0.89 2.54,2.41 2.54,2.54 4.95,4.95 4.95,5.41 LED2.3
  Bottom 0.254: LED2.3 4.16,6.32 4.95,7.11 4.95,7.62 5.71,8.38 5.71,9.15 Q3.C
GND  (via drill 0.2)  (1 unrouted)
  Top 0.127: 15.88,11.68 9.53,11.68 9.27,11.43 | CON_PROG.5 14.81,15.49
  Top 0.254: 14.81,15.49 13.72,15.49 13.46,15.24 CON_PROG.16
  Top 0.381: BAT1-1.1 15.49,28.62 | BAT2-1.1 17.53,28.75
  Bottom 0.127: Q3.E 8.24,8.62 R15.1 | Q2.E 8.37,10.78 R14.1 | 6.35,9.91 6.22,9.78 4.95,9.78 4.95,9.53 | 15.22,14.37 IC1.3 15.46,14.1 16,14.1 | IC1.5 15.24,12.95 | R16.1 7.75,12.83 7.62,12.95
  Bottom 0.635: 13,25.32 12.83,25.15 | 22.82,12.23 22.99,12.06 | 10.41,3.43 10.29,3.3 | 3.18,14.6 3.3,14.48
  other vias: 9.27,7.62 1.14,13.72 9.02,3.68 5.59,16 5.97,19.68 19.3,18.63 20.95,12.83 11.05,28.96 24.89,26.67 6.22,1.4 16.13,13.21 19.05,4.95 13.72,24 20.7,19.43 13.21,10.03 6.35,12.19 5.84,10.41 16.76,24.13 11.43,21.59 16.38,12.06 9.4,18.16 15.11,11.94
  pour Bottom (isolate 0.127): 0,3.43 0,27.56 3.43,30.99 22.61,30.99 26.04,27.56 26.04,3.43 22.61,0 3.43,0
  pour Top (isolate 0.127): 0,3.43 0,27.56 3.43,30.99 22.61,30.99 26.04,27.56 26.04,3.56 22.48,0 3.43,0
I2C_ADC0  (via drill 0.2, 0.2 pad 0.5)
  Top 0.127: v8.26,19.81 8.26,17.4 8.4,17.25 9.8,17.25 10.29,16.76 11.18,16.76 CON_PROG.13 | IC8.3 9.65,23.62 9.53,23.5 9.53,23.24 8.26,21.97 v8.26,21.84
  Bottom 0.127: v8.26,21.84 v8.26,19.81
I2C_ADC1  (via drill 0.2)
  Top 0.127: CON_PROG.12 10.18,17.25 9.91,17.53 8.64,17.53 8.51,17.65 8.51,19.43 10.16,21.08 12.32,21.08 v12.45,21.21 | IC8.4 v11.68,23.11
  Bottom 0.127: v11.68,23.11 12.32,23.11 12.45,22.99 v12.45,21.21
INT0  (via drill 0.2)
  Top 0.127: R4.2 16.76,16.38 v16.64,16.26 16.26,15.88 16.26,15.37 15.64,14.75 CON_PROG.4
  Bottom 0.127: v16.64,16.26 16.23,16.26 IC1.32
INT1  (via drill 0.2)
  Top 0.127: CON_PROG.3 15.65,14.25 16.76,15.37 v16.76,15.49 17.14,15.88 R5.2
  Bottom 0.127: v16.76,15.49 16.32,15.49 IC1.1
IR_SD  (via drill 0.2)
  Top 0.127: v17.4,11.3 17.27,11.18 R9.1
  Top 0.254: IC4.4 17.3,3.02 R9.1
  Bottom 0.127: IC1.2 15.63,14.72 15.88,14.48 17.27,14.48 17.4,14.35 v17.4,11.3
IRDA
  Top 0.254: R10.2 20.32,2.16 IC4.1
LED1
  Bottom 0.127: IC1.10 9.4,10 R17.2 9.27,8.26 R19.1
LED2
  Bottom 0.127: 13.78,18.1 IC1.26 15.93,20.19 17.4,20.19 18.16,20.95 R18.2 R20.1
LED3
  Bottom 0.127: IC1.9 12.58,12.58 10.54,10.54 10.54,5.84 10.92,5.46 17.65,5.46 | R25.1 17.65,5.46 | 17.65,5.46 R23.2
LED4
  Bottom 0.127: 13.45,18.4 IC1.25 14.33,19.3 14.33,19.83 14.22,19.94 8.89,19.94 8.76,20.07 8.76,23.37 9.27,23.88 R26.1
  Bottom 0.254: R26.1 R24.2
LED_B
  Bottom 0.127: IC1.13 11.09,14.02 9.65,12.57 9.14,12.57 9.02,12.7 9.02,13.72 8.89,13.71 R13.2
LED_G
  Bottom 0.127: IC1.12 9.92,12.06 R11.2
LED_R
  Bottom 0.127: IC1.11 9.02,10.33 R12.2
MISO  (via drill 0.2)
  Top 0.127: v9.53,14.35 9.65,14.35 10.29,13.72 11.16,13.72 CON_PROG.19
  Bottom 0.127: IC1.16 10.1,15.05 9.53,14.48 v9.53,14.35
MOSI  (via drill 0.2)
  Top 0.127: v9.53,13.72 10.03,13.21 11.15,13.21 CON_PROG.20
  Bottom 0.127: IC1.15 10.4,14.72 10.03,14.35 10.03,14.1 9.65,13.72 v9.53,13.72
N$1  (via drill 0.2)
  Top 0.254: IC5.1 21.1,25.16 v20.45,24.51
  Bottom 0.254: v20.45,24.51 20.57,24.51 21.59,23.5 21.59,22.61 MOT1.1
N$2
  Top 0.254: IC5.2 21.6,24.77 20.83,24 R29.2
N$3  (via drill 0.2)
  Top 0.127: R6.1 8.89,14.48 9.02,14.35 9.02,13.34 9.27,13.08 v9.53,13.08
  Bottom 0.127: 9.65,13.08 v9.53,13.08 v9.53,13.09 IC1.14
N$4
  Top 0.127: R1.2 24.26,7.87 24.26,8.89 Q1.1
N$5
  Bottom 0.254: LED2.4 6.36,4.05 R21.1
N$6
  Top 0.254: IC7.1 5.06,5.95 6.22,7.11 6.22,8.38 6.1,8.51 4.45,8.51 MOT3.1
N$7
  Top 0.254: 5.21,7.53 R31.2 5.33,7.53 4.56,6.76 IC7.2
N$8
  Top 0.254: R6.2 3.8,13.97 LED1.A
N$10
  Bottom 0.254: LED4.4 21.9,6.32 R27.1
N$11
  Bottom 0.254: Q7.E 21.17,7.76 R27.2 21.64,7.42 22.23,8 23.62,6.6 23.62,6.36 LED4.5 LED4.6
N$15
  Bottom 0.254: R22.1 18.62,26.62 19.3,27.3 19.68,26.92 LED3.4 | LED3.4
N$16  (1 unrouted)
  Bottom 0.127: 20.57,27.69 21.34,26.92 21.34,26.8 20.07,25.53 19.68,25.53 R22.2 | R22.2 18.92,26.29 | R22.2 18.98,26.21 18.92,26.16
  Bottom 0.254: Q6.E 18.15,25.39 18.92,26.16 | LED3.5 LED3.6
N$19
  Bottom 0.127: 18.16,23.09 18.57,23.09 18.67,22.99 R20.2
  Bottom 0.254: 18.16,23.09 Q6.B
N$20
  Bottom 0.254: 4.37,24.37 LED5.4 4.64,25.27 4.93,25.27 R28.1
N$22  (1 unrouted)
  Bottom 0.127: 5.45,23.1 5.33,23.11 5.33,24.13 5.21,24.26
  Bottom 0.254: Q8.E 5.45,23.1 | LED5.6 LED5.5 2.54,24.8 2.54,23.5 3.3,22.73 4.95,22.73 5.33,23.11
N$23
  Bottom 0.254: Q8.B 8.75,24.4 R26.2
N$24
  Bottom 0.127: R25.2 18.16,6.45 Q7.B
N$25
  Bottom 0.127: Q5.B 8.62,7.76 R19.2
N$26
  Bottom 0.127: IC1.20 11.08,16.98 C2.1
N$27
  Bottom 0.254: LED2.6 LED2.5 6.33,2.41 6.6,2.41 8,3.81 R21.2 7.63,4.6 Q5.E
N$28
  Top 0.254: LED6.A R33.1
P_BAT1+
  Top 0.254: SWITCH_PWR.3 7.24,19.59 7.24,17.14 7.63,16.75 9.67,16.75 10.16,16.26 CON_PROG.14
P_BAT2+
  Top 0.254: SWITCH_PWR.6 1.62,19.56 4.19,19.56 7.5,16.25 9.53,16.25 10.03,15.75 CON_PROG.15
RESET  (via drill 0.2)
  Top 0.127: CON_PROG.7 15.62,16.25 16.51,17.14 16.51,17.91 v17.02,18.41
  Bottom 0.127: IC1.29 15.82,17.97 R2.2 15.9,17.9 16.5,17.9 16.89,18.29 v17.02,18.41
RSCL  (via drill 0.2)
  Top 0.127: R34.1 v17.02,21.08 16.51,20.57 16.51,19.43 | 16.51,19.43 16.51,18.8 16.26,18.54 16.26,17.27 15.73,16.75 CON_PROG.8 | v16.76,19.43 16.51,19.43
  Bottom 0.127: IC1.28 14.54,17.34 16.64,19.43 v16.76,19.43 | IC2.1 17.19,22.57 17.4,22.35 17.4,21.46 v17.02,21.08
RSDA  (via drill 0.2)
  Top 0.127: R35.1 v16.89,21.84 16.38,21.84 16.26,21.72 16.26,19.05 16,19.05 | v15.49,19.05 16,19.05 | 14.83,17.27 CON_PROG.9 15.85,17.25 16,17.4 16,19.05
  Bottom 0.127: IC2.2 17.07,21.91 v16.89,21.84 | IC1.27 v15.49,19.05 IC1.27
RXD  (via drill 0.2)
  Top 0.127: v17.09,17.75 v18.8,17.75 | v19.43,11.18 18.54,11.18 18.41,11.05 18.41,9.31 IC3.3
  Bottom 0.127: IC1.30 15.23,16.63 16,17.4 16.62,17.4 v17.09,17.75 | v19.43,11.18 19.43,12.06 18.67,12.83 18.67,17.62 v18.8,17.75
RXIR
  Top 0.254: IC3.6 18.47,2.21 IC4.3
SCK  (via drill 0.2)
  Top 0.127: CON_PROG.18 11.16,14.22 10.29,14.22 9.65,14.86 9.14,14.86 v9.02,14.99
  Bottom 0.127: IC1.17 10.08,15.8 9.83,15.8 v9.02,14.99
SCL  (via drill 0.2)
  Top 0.127: IC6.7 8.19,2.73 8,3.05 | 8,3.05 5.14,3.05 5.06,2.97 IC7.10 | v15.37,10.67 15.11,10.92 10.54,10.92 10.41,10.79 10.41,5.33 9.53,4.45 8.13,4.45 8,4.32 8,3.05 | IC5.10 20.4,28.4 19.94,27.94 19.94,25.15 | 19.94,25.15 19.94,20.32 18.8,19.18 v17.78,19.18 | v20.32,25.15 19.94,25.15 | v19.05,25.15 18.54,24.64 16.64,24.64 16.13,25.15 15.75,25.15 15.62,25.02 13.59,25.02 13.21,24.64 13.21,23.37 v13.34,23.24 13.46,23.11 IC8.7 | R8.1 8.25,1.02 8.19,1.08
  Top 0.254: IC6.7 8.19,1.08
  Bottom 0.127: v15.37,10.67 15.88,10.16 18.41,10.16 18.67,10.41 18.67,11.68 18.03,12.32 18.03,18.92 v17.78,19.18 18.03,18.93 | v19.05,25.15 v20.32,25.15 | IC2.5 12.87,20.61 13.21,20.95 13.21,23.11 v13.34,23.24
SDA  (via drill 0.2)
  Top 0.127: IC6.6 7.7,2.33 | 7.7,2.33 7.37,2.67 5.59,2.67 5.46,2.54 5.46,2.29 5.33,2.16 4.7,2.16 4.57,2.29 4.57,2.83 IC7.9 | 7.7,2.33 7.75,2.29 7.75,2.03 | v10.29,1.4 10.29,4.83 10.67,5.21 10.67,10.54 10.79,10.67 14.35,10.67 v14.61,10.41 | IC5.9 21.6,28.95 21.46,29.08 20.7,29.08 19.68,28.07 19.68,25.78 | 19.68,25.78 19.68,20.45 18.92,19.68 v18.29,19.68 | IC8.6 v13.72,22.63 13.06,22.63 12.83,22.86 12.83,24.64 13.46,25.27 15.49,25.27 15.62,25.4 16.26,25.4 16.76,24.89 18.29,24.89 18.54,25.15 18.54,25.65 18.67,25.78 19.68,25.78 | v7.11,1.4 7.58,1.4 7.7,1.52 | R7.1 7.7,1.1
  Top 0.254: IC6.6 7.7,1.52 7.7,1.1
  Bottom 0.127: v7.11,1.4 v10.29,1.4 | v14.61,10.41 15.11,9.91 18.67,9.91 18.92,10.16 18.92,11.94 18.29,12.57 v18.29,19.68 18.4,19.68 | IC2.4 13.8,20.61 13.72,20.7 v13.72,22.63
SENS_MOTL1
  Top 0.127: R30.1 22.52,22.99 22.86,22.99 23.24,22.61 23.62,22.61 24.13,22.1 24.13,20.95 24,20.83 21.46,20.83 21.34,20.7 21.34,19.05 20.57,18.29 20.57,15.37 20.32,15.11 17.4,15.11 17.27,14.99 17.27,12.32 16.38,11.43 9.91,11.43 9.78,11.3 9.78,7.24 9.69,7.15 IC6.1
  Top 0.254: IC5.3 22.1,23.41 R30.1
SENS_MOTL2
  Top 0.127: IC6.2 9.2,5.53 9.4,5.33 10.03,5.33 10.16,5.46 10.16,11.05 10.29,11.18 16.51,11.18 17.53,12.19 17.53,14.61 17.78,14.86 20.7,14.86 20.83,14.99 20.83,18.16 MOT2.1
  Top 0.254: MOT2.1 23.62,19.68 24.51,20.57 24.51,22.23 23.84,22.9 R30.2
SENS_MOTR1
  Top 0.127: R32.1 3.52,8 3.3,8 2.79,8.51 2.79,9.78 3.3,10.29 4.57,10.29 5.21,10.92 6.1,10.92 6.6,10.41 6.6,6.99 5.97,6.35 5.97,5.71 6.73,4.95 8.26,4.95 8.7,5.39 IC6.3
  Top 0.254: IC7.3 4.06,7.45 R32.1
SENS_MOTR2
  Top 0.127: MOT4.1 6.35,11.3 6.86,10.79 6.86,6.73 6.73,6.6 6.6,6.6 6.22,6.22 6.22,5.84 6.73,5.33 7.87,5.33 8.19,5.65 IC6.4
  Top 0.254: R32.2 2.2,9.69 MOT4.1
SRXD  (via drill 0.2)
  Top 0.127: v11.56,18.92 11.56,18.12 CON_PROG.11
  Bottom 0.127: IC1.23 12.18,18.05 11.56,18.67 v11.56,18.92
STXD  (via drill 0.2)
  Top 0.127: v12.19,19.05 13.64,19.05 CON_PROG.10
  Bottom 0.127: IC1.24 12.58,18.41 12.19,18.8 v12.19,19.05
TXD  (via drill 0.2)
  Top 0.127: v17.02,17.02 v19.18,17.02 | v19.43,10.41 19.18,10.16 19.18,9.31 IC3.2
  Bottom 0.127: IC1.31 15.64,16.28 16.38,17.02 v17.02,17.02 | v19.43,10.41 19.94,10.92 19.94,11.94 18.92,12.95 18.92,16.76 v19.18,17.02
TXIR
  Top 0.254: IC3.7 19.12,2.07 IC4.2
VCC  (via drill 0.2, 0.2 pad 0.5)  (1 unrouted)
  Top 0.127: 16.38,1.14 20.83,1.14 20.95,1.27 20.95,3.56 | 16.38,1.14 16.38,0.64 16.26,0.51 9.91,0.51 9.69,0.73 IC6.10 | 16.38,1.14 16.38,1.96 IC4.5 | v16.64,13.72 16.64,14.73 17.27,15.37 18.03,15.37 | 18.03,15.37 20.07,15.37 20.19,15.49 20.19,20.07 v20.45,20.32 | 18.03,15.37 17.78,15.62 R5.1 R4.1 | IC8.10 v16,24.61 16,23.62 | R7.2 | R8.2 8.13,0.51 8.64,0.51 | R1.1 22.86,7.49 22.48,7.87 22.48,8.97 Q1.4 | R35.2 R34.2 v18.8,21.08 | IC8.8 16,23.62 | R35.2 | 16,23.62 18.03,23.62 18.16,23.5 R35.2 | 0.64,14.99 v6.73,14.99
  Top 0.254: R1.1 23.37,3.68 23.24,3.56 20.95,3.56 R10.1 19.88,3.56 IC3.8 19.94,3.62 v19.94,5.97 | IC7.7 3.56,1.01 | 3.56,1.01 4.06,0.51 R7.2 8.64,0.51 9.53,0.51 9.69,0.67 IC6.10 | 3.56,1.01 1.4,3.17 1.4,6.6 | IC7.4 3.56,6.47 3.43,6.6 1.4,6.6 | 1.4,12.32 1.4,6.6 | v24.64,24.26 22.73,24.26 22.61,24.38 IC5.4 | D1.C 6.1,27.56 6.73,26.92 v6.73,25.78 | D2.C 3.77,28.66 0.64,25.53 0.64,14.99 0.64,12.57 0.76,12.45 1.27,12.45 1.4,12.32 | 7.24,12.95 7.24,6.35 6.99,6.1 v6.73,6.1 | 7.24,12.95 8.89,12.95 9.14,12.7 | 9.14,12.7 9.4,12.45 14.01,12.45 14.26,12.7 | 14.26,12.7 CON_PROG.1 | 14.26,12.7 v16.64,12.7 v16.64,13.72 | 7.24,12.95 2.03,12.95 1.4,12.32 | R33.2 9.14,12.7
  Top 0.305: IC4.5 16.35,2.32 16.26,2.41 16.26,3.19 C5.1
  Top 0.381: D2.C D1.C
  Bottom 0.127: v16.64,13.72 15.14,13.72 IC1.4 | R2.1 16.18,18.38 16.6,18.93 17.27,18.93 | Q6.C | v16,24.61 15.98,24.64 14.61,24.64 14.61,21.59 14.93,21.27 IC2.3 | 17.27,18.93 17.27,19.56 v18.8,21.08 | IC1.6 14.19,13.31 14.8,12.7 15.88,12.7 | 15.88,12.7 v16.64,12.7 | 15.88,12.7 15.88,10.54 16,10.41 18.29,10.41 18.41,10.54 18.41,11.56 17.78,12.19 17.78,18.67 17.53,18.67 17.27,18.92 17.27,18.93 | v6.73,14.99 6.99,14.73 8,14.73 9.91,16.64 | IC1.18
  Bottom 0.178: 20.83,20.7 24.38,20.7
  Bottom 0.254: Q7.C v19.95,5.98 v19.94,5.97 | 24.38,20.7 24.64,20.95 v24.64,24.26 | Q8.C 6.08,25.14 6.1,25.15 6.1,25.65 6.22,25.78 v6.73,25.78 | C1.1 10.02,16.71 IC1.18 | Q6.C 19.95,20.69 20.32,20.32 v20.45,20.32 20.83,20.7 | Q5.C 5.84,7.11 5.84,6.99 v6.73,6.1
X1  (1 unrouted)
  Bottom 0.127: 7.65,14.22 Q4.B | R16.2 8.51,13.36 Q4.B | R13.1 7.64,14.35 Q4.B
X2
  Bottom 0.127: Q3.B 8.37,9.92 R12.1 8.51,9.53 R15.2
X3
  Bottom 0.127: Q2.B 8.37,12.08 R11.1 8.51,11.56 R14.2
XTAL1
  Bottom 0.127: IC1.7 13.84,12.95 14.35,12.45 14.35,11.05 13.97,10.67 13.97,7.11 14.22,6.86 15.61,6.86 Q9.3 15.62,6.71 C3.1
XTAL2
  Bottom 0.127: 11.81,8.65 Q9.1 11.81,9.15 C4.1 11.81,10.28 11.81,10.29 11.81,10.99 IC1.8
(copper drawn outside any net)
  shapes: Bottom area x3, Top area x3

### Text on the board
tTest: BAT+ | BAT- | ON | + | OFF | NorthernStars | - | MOTOR | + | MOTOR | - | mrShark | v. 1.1